# EAGLE design Filtro 8vo Orden (EAGLE 9.6.1)
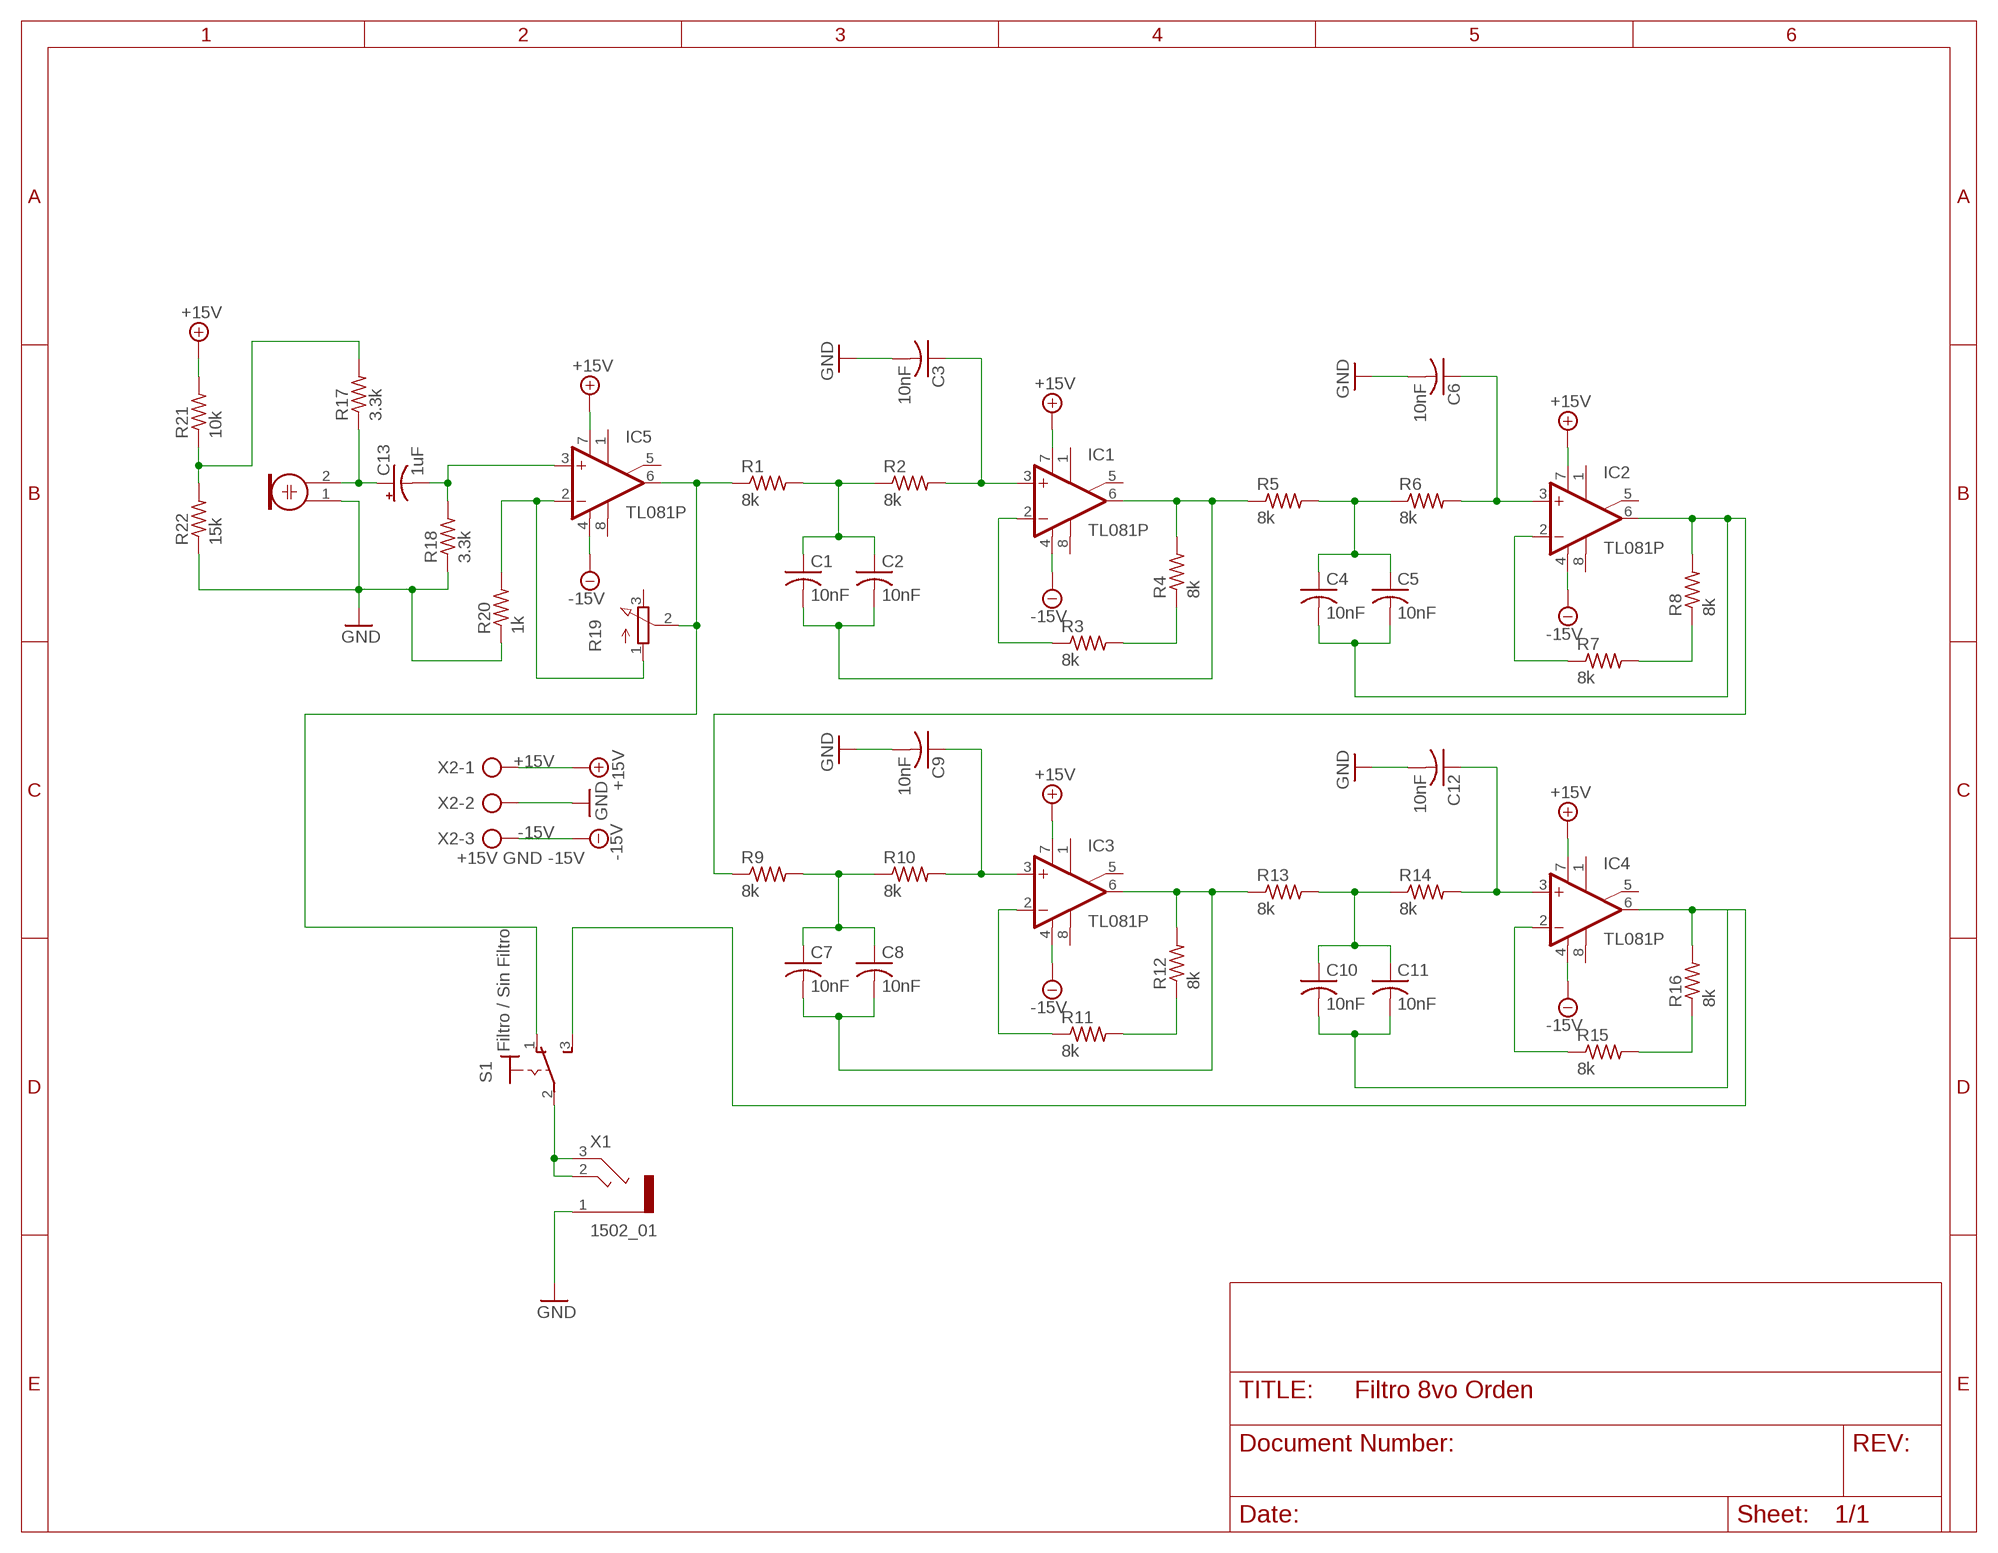
[diagram p0: schematic, sheet 1]

## Parts
C1  10nF  C-USC0805  [C0805]
C2  10nF  C-USC0805  [C0805]
C3  10nF  C-USC0805  [C0805]
C4  10nF  C-USC0805  [C0805]
C5  10nF  C-USC0805  [C0805]
C6  10nF  C-USC0805  [C0805]
C7  10nF  C-USC0805  [C0805]
C8  10nF  C-USC0805  [C0805]
C9  10nF  C-USC0805  [C0805]
C10  10nF  C-USC0805  [C0805]
C11  10nF  C-USC0805  [C0805]
C12  10nF  C-USC0805  [C0805]
C13  1uF  CPOL-USE1.8-4  [E1,8-4]
IC1  TL081P  [DIL08]
IC2  TL081P  [DIL08]
IC3  TL081P  [DIL08]
IC4  TL081P  [DIL08]
IC5  TL081P  [DIL08]
M1  ELECTRET_MICROPHONWM-63PR  [WM-63PR]
R1  8k  R-US_0204/7  [0204/7]
R2  8k  R-US_0204/7  [0204/7]
R3  8k  R-US_0204/7  [0204/7]
R4  8k  R-US_0204/7  [0204/7]
R5  8k  R-US_0204/7  [0204/7]
R6  8k  R-US_0204/7  [0204/7]
R7  8k  R-US_0204/7  [0204/7]
R8  8k  R-US_0204/7  [0204/7]
R9  8k  R-US_0204/7  [0204/7]
R10  8k  R-US_0204/7  [0204/7]
R11  8k  R-US_0204/7  [0204/7]
R12  8k  R-US_0204/7  [0204/7]
R13  8k  R-US_0204/7  [0204/7]
R14  8k  R-US_0204/7  [0204/7]
R15  8k  R-US_0204/7  [0204/7]
R16  8k  R-US_0204/7  [0204/7]
R17  3.3k  R-US_0204/7  [0204/7]
R18  3.3k  R-US_0204/7  [0204/7]
R19  3RP/1610N  [3RP/1610N]
R20  1k  R-US_0204/7  [0204/7]
R21  10k  R-US_0204/7  [0204/7]
R22  15k  R-US_0204/7  [0204/7]
S1  Filtro / Sin Filtro  320-916  [320-916]
X1  1502_01  [1502_01]
X2  +15V GND -15V  AK300/3  [AK300/3]

## Nets
+15V: IC1.7(V+) IC2.7(V+) IC3.7(V+) IC4.7(V+) IC5.7(V+) R21.2 X2.1
-15V: IC1.4(V-) IC2.4(V-) IC3.4(V-) IC4.4(V-) IC5.4(V-) X2.3
GND: C3.2 C6.2 C9.2 C12.2 M1.1 R18.1 R20.1 R22.1 X1.1 X2.2
N$1: C6.1 IC2.3(+IN) R6.2
N$2: C3.1 IC1.3(+IN) R2.2
N$3: R3.2 R4.1
N$4: C4.1 C5.1 R5.2 R6.1
N$5: C4.2 C5.2 IC2.6(OUT) R8.2 R9.1
N$6: C1.1 C2.1 R1.2 R2.1
N$7: C1.2 C2.2 IC1.6(OUT) R4.2 R5.1
N$8: IC1.2(-IN) R3.1
N$9: IC2.2(-IN) R7.1
N$10: R7.2 R8.1
N$11: C9.1 IC3.3(+IN) R10.2
N$12: C7.1 C8.1 R9.2 R10.1
N$13: C7.2 C8.2 IC3.6(OUT) R12.2 R13.1
N$14: IC3.2(-IN) R11.1
N$15: R11.2 R12.1
N$16: C12.1 IC4.3(+IN) R14.2
N$17: C10.1 C11.1 R13.2 R14.1
N$18: C10.2 C11.2 IC4.6(OUT) R16.2 S1.3(S)
N$19: IC4.2(-IN) R15.1
N$20: R15.2 R16.1
N$21: C13.+ M1.2 R17.1
N$22: C13.- IC5.3(+IN) R18.2
N$23: R17.2 R21.1 R22.2
N$24: IC5.2(-IN) R19.1(A) R20.2
N$26: S1.2(P) X1.2 X1.3
N$28: IC5.6(OUT) R1.1 R19.2(S) S1.1(O)
Unconnected: IC1.1(ON1) IC1.5(ON2) IC1.8(OPT) IC2.1(ON1) IC2.5(ON2) IC2.8(OPT) IC3.1(ON1) IC3.5(ON2) IC3.8(OPT) IC4.1(ON1) IC4.5(ON2) IC4.8(OPT) IC5.1(ON1) IC5.5(ON2) IC5.8(OPT) R19.3(E)

## Library data of the parts
C1-C12 = rcl:C-US: CAPACITOR, American symbol; SPICEPREFIX: C
C13 = rcl:CPOL-US: POLARIZED CAPACITOR, American symbol; SPICEPREFIX: C
IC1-IC5 = linear:TL081: OP AMP
M1 = Componentes_Filtros:ELECTRET_MICROPHON: Electret Condenser Microphone
R1-R18 R20-R22 = rcl:R-US_: RESISTOR, American symbol; SPICEPREFIX: R
R19 = Componentes_Filtros:3RP/1610N: 16mm Potentiometer one level Source: http://www.alphapotentiometers.net/html/16mm_pot_2.html
S1 = Componentes_Filtros:320-916: TOGGLE SWITCH distributor RS Components
X1 = Componentes_Filtros:1502_01: Jack connectors according to JISC 6560, 3.5 mm Klinkensteckverbinder nach JISC 6560, 3,5 mm Source: http://www.lumberg.com/Produkte/PDFs/1502_01.pdf; OC_FARNELL: 4739747; OC_NEWARK: unknown
X2 = Componentes_Filtros:AK300/3: CONNECTOR; OC_FARNELL: unknown; OC_NEWARK: unknown

## Board
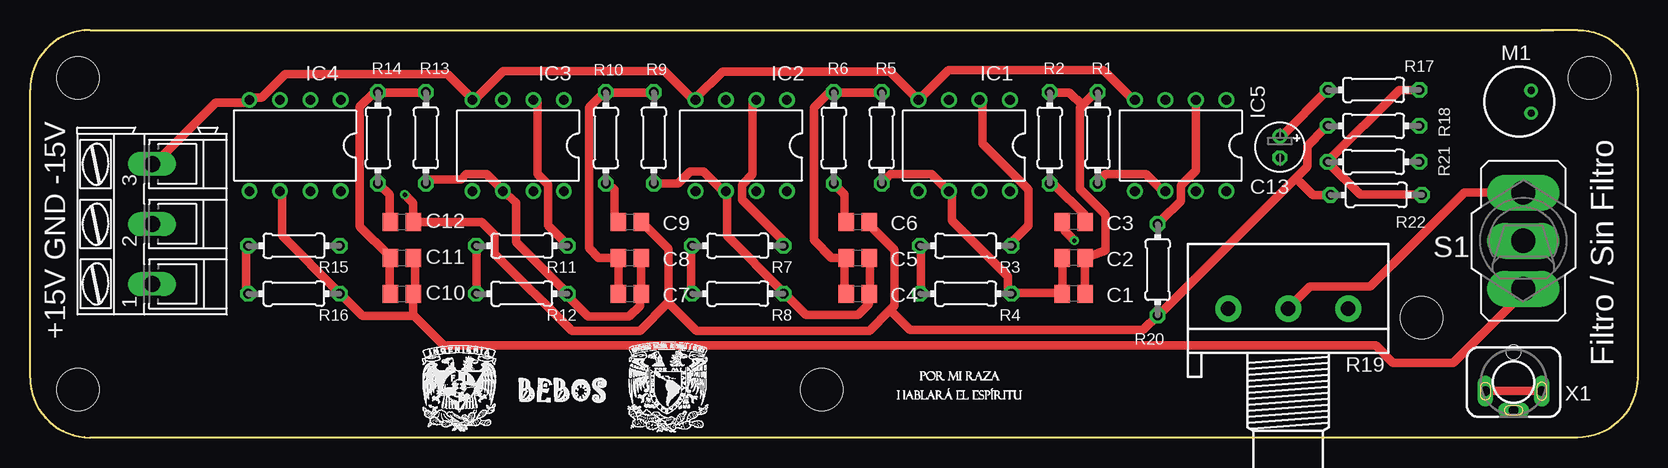
[diagram p1: board, top side]
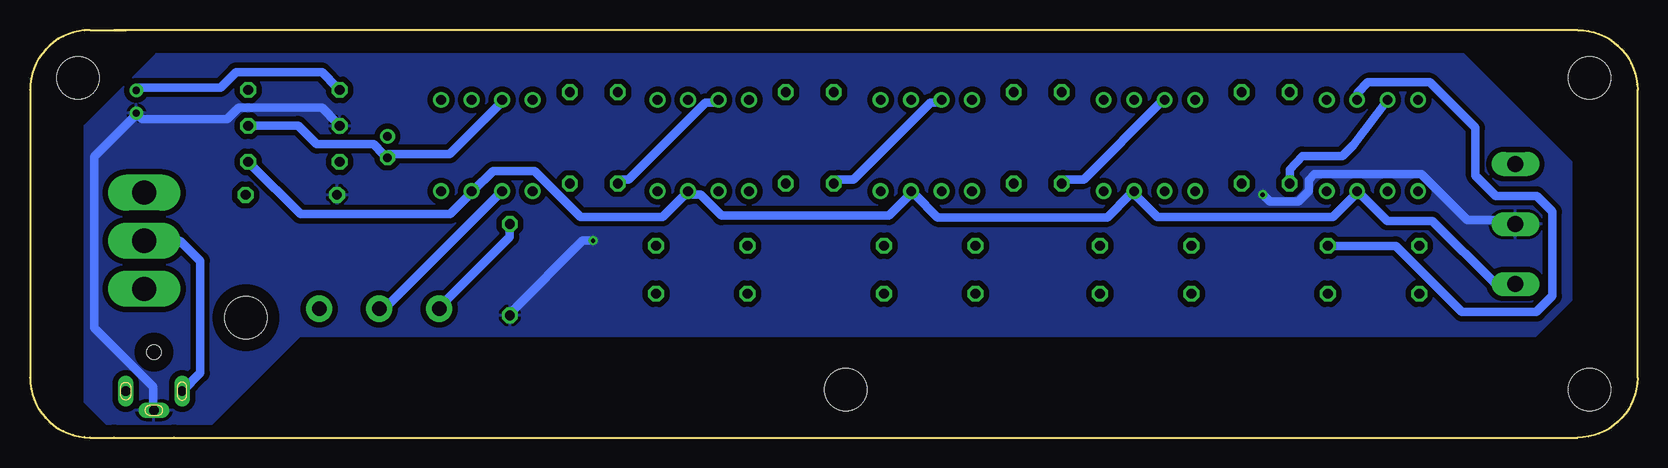
[diagram p2: board, bottom side, seen from below]

Size 134 x 34 mm. Coordinates in mm from the lower left corner, seen from the top.
Outline: 126,34 5,34 arc90 0,29 0,5 arc90 5,0 122,0
Outline: 126,34 127,34
Outline: 127,0 122,0
Outline: 126,34 129,34 arc-90 134,29 134,5 arc-90 129,0 122,0
Copper layers (1*16): Top 0.035mm / dielectric 1.5mm / Bottom 0.035mm
Design rules "default *": minimum track width 0.7mm, minimum drill 0.35mm, track to track 6mil, track to pad 6mil, pad to pad 6mil, via to via 6mil, smd to smd 6mil, copper to edge 40mil, drill to drill 6mil, minimum pad ring 10mil, minimum via ring 8mil, stop-mask expansion 4mil, vias tented up to drill 0mil, thermal gap 10mil
Holes 3.5 mm at 4,30 4,4 66,4 116,10 130,30

### Footprints (pad centres in the part's own frame; a part is rotated, then mirrored left to right if it is on the bottom)
C0805 = smd 1.3 x 1.5: 1 -0.95,0; 2 0.95,0
E1,8-4 = drill 0.711 pad 1.168: + -0.889,0 | drill 0.711 pad 1.168 octagon: - 0.889,0
DIL08 = drill 0.813 pad 1.27: 1 -3.81,-3.81; 2 -1.27,-3.81; 3 1.27,-3.81; 4 3.81,-3.81; 5 3.81,3.81; 6 1.27,3.81; 7 -1.27,3.81; 8 -3.81,3.81
WM-63PR = drill 0.6 pad 1: 1 -1,0.95; 2 -1,-0.95
0204/7 = drill 0.813 octagon: 1 -3.81,0; 2 3.81,0
3RP/1610N = drill 1.2 pad 2.184: 1 -5,0; 2 0,0; 3 5,0
320-916 = drill 2.007 long: 1 0,4.013; 2 0,0; 3 0,-4.013
1502_01 = drill 0.8 pad 1.2 long: 1 0,2.35; 2 -2.35,0.75; 3 2.35,0.75 | hole 1.2: 0,-2.5
AK300/3 = drill 1.321 long: 1 -5.004,0; 2 0,0; 3 5.004,0

### Placement (x,y rotation side)
C1  87,12 180 top
C2  87,15 180 top
C3  87,18 180 top
C4  69,12 0 top
C5  69,15 0 top
C6  69,18 0 top
C7  50,12 0 top
C8  50,15 0 top
C9  50,18 0 top
C10  31,12 0 top
C11  31,15 0 top
C12  31,18 0 top
C13  104.19,24.23 270 top
IC1  77.87,24.36 180 top
IC2  59.28,24.36 180 top
IC3  40.69,24.36 180 top
IC4  22.1,24.36 180 top
IC5  95.92,24.36 180 top
M1  124.13,28.01 180 top
R1  89,25 90 top
R2  85,25 270 top
R3  78,16 180 top
R4  78,12 0 top
R5  71,25 90 top
R6  67,25 270 top
R7  59,16 180 top
R8  59,12 0 top
R9  52,25 90 top
R10  48,25 270 top
R11  41,16 180 top
R12  41,12 0 top
R13  33,25 90 top
R14  29,25 270 top
R15  22,16 180 top
R16  22,12 0 top
R17  112,29 0 top
R18  112,26 0 top
R19  104.89,10.75 0 top
R20  94,14 90 top
R21  112,23 0 top
R22  112.22,20.24 0 top
S1  124.48,16.41 0 top
X1  123.67,4.62 180 top
X2  10.18,17.81 90 top

### Tracks (layer width: path | path; a pad name or v marks a point on that pad's centre or on a via)
+15V
  Bottom 0.7: X2.1 11.82,12.81 17.09,18.07 20.87,18.07 23.06,20.26 23.14,20.26 IC4.7 23.37,20.42 25.39,18.4 40.04,18.4 41.9,20.26 IC3.7 42.32,20.26 44.2,18.37 58.34,18.37 60.22,20.26 IC2.7 60.65,20.26 62.4,18.51 76.37,18.51 78.12,20.26 78.98,20.26 IC1.7 79.4,20.26 81.25,18.41 88.11,18.41 91.94,22.24 95.39,22.24 97,20.63 IC5.7 97.3,20.26 97.33,20.26 98.96,18.63 111.44,18.63 115.63,22.81 R21.2
-15V
  Top 0.7: IC5.4 91.76,28.35 89.47,30.65 76.58,30.65 74.29,28.35 IC1.4 73.86,28.35 71.67,30.54 57.72,30.54 55.53,28.35 IC2.4 55.11,28.35 52.9,30.56 39.42,30.56 37.21,28.35 IC3.4 36.78,28.35 34.83,30.31 21.27,30.31 19.31,28.35 18.46,28.35 IC4.4 18.03,27.93 15.47,27.93 10.36,22.81 X2.3
GND  (via drill 0.35)
  Top 0.7: v87.07,16.42 86.22,17.27 86.22,17.7 C3.2 | R22.1 106.96,20.24 105.53,21.67 | R18.1 107.96,25.8 106.49,24.33 106.49,22.62 105.53,21.67 | 105.53,21.67 94.32,10.45 R20.1 92.77,8.96 73.37,8.96 71.69,10.64 | 53.2,11.26 53.23,11.29 53.23,15.74 51.27,17.7 C9.2 | 53.2,11.26 50.84,8.9 45.17,8.9 38.74,15.33 38.74,16.9 37.64,18 C12.2 | C12.2 32.09,17.7 | 71.69,10.64 69.96,8.91 55.56,8.91 53.2,11.26 | 71.69,10.64 72.08,11.03 72.08,15.65 70.03,17.7 C6.2 | v31.24,20.26 31.94,19.56 31.94,19.51 31.95,19.5 C12.2
  Bottom 0.7: v87.07,16.42 87.93,16.42 93.89,10.45 R20.1 | R18.1 108.38,26.22 109.66,27.5 116.61,27.5 117.54,26.57 124.64,26.57 M1.1 125.43,26.65 128.64,23.44 128.64,9.15 123.73,4.24 123.73,2.36 X1.1 | v31.24,20.26 30.66,19.68 28.28,19.68 27.4,20.56 27.4,21.49 26.93,21.96 18.03,21.96 14.19,18.13 10.36,18.13 X2.2
  pour Bottom (isolate 0.45): 5.5,15.5 5.5,23 14.5,32 123.5,32 129.5,26 129.5,3 127.5,1 119,1 111.5,8.5 8.5,8.5 6,11 5.5,11.5
N$1
  Top 0.7: C6.1 67.89,18.13 67.89,20.26 67.04,21.11 R6.2
  Bottom 0.7: IC2.3 58.09,27.93 58.94,27.93 65.34,21.53 66.62,21.53 R6.2
N$2
  Top 0.7: C3.1 87.93,18.13 87.93,18.55 85.37,21.11 R2.2
  Bottom 0.7: IC1.3 76.84,27.93 77.7,27.93 84.09,21.53 84.94,21.53 R2.2
N$3
  Top 0.7: R4.1 74.29,12.16 74.29,16 R3.2
N$4
  Top 0.7: C4.1 67.89,12.16 67.89,14.72 C5.1 66.83,15 65.34,16.49 65.34,27.5 66.62,28.78 R6.1 67.04,28.78 70.88,28.78 R5.2
N$5
  Top 0.7: R9.1 54.02,21.2 55.01,22.19 56.16,22.19 57.67,20.68 IC2.6 58.09,20.26 58.09,16.85 62.78,12.16 R8.2 63.21,11.73 64.69,10.24 69.04,10.24 69.94,11.14 69.94,11.99 C4.2 70.03,12.16 70.03,14.72 C5.2
N$6
  Top 0.7: C1.1 87.93,12.16 87.93,14.72 C2.1 89.66,15.6 89.66,18.59 87.5,20.74 87.5,27.5 87.71,27.72 | 87.71,27.72 88.78,28.78 R1.2 | 87.71,27.72 86.65,28.78 85.37,28.78 R2.1
N$7
  Top 0.7: C2.2 C1.2 85.93,12.08 81.88,12.08 R4.2 81.53,12.16 81.53,13.44 76.84,18.12 76.84,20.26 IC1.6 76.42,20.68 75.14,21.96 71.73,21.96 71.31,21.53 R5.1
N$8
  Top 0.7: IC1.2 79.4,27.93 79.4,24.52 83.24,20.68 83.24,17.7 81.96,16.42 R3.1
N$9
  Top 0.7: IC2.2 60.22,27.93 60.22,21.96 59.33,21.07 59.33,19.87 62.78,16.42 R7.1
N$10
  Top 0.7: R8.1 55.11,12.16 55.11,16 R7.2
N$11
  Top 0.7: C9.1 48.72,18.13 48.72,20.68 48.29,21.11 R10.2
  Bottom 0.7: IC3.3 39.77,27.93 46.16,21.53 47.86,21.53 R10.2
N$12
  Top 0.7: C7.1 49.06,12.01 49.06,14.97 C8.1 47.41,15 46.58,15.82 46.58,27.5 47.86,28.78 R10.1 48.29,28.78 51.7,28.78 R9.2
N$13
  Top 0.7: R13.1 33.37,21.53 35.93,21.53 36.36,21.96 38.06,21.96 39.34,20.68 IC3.6 40.52,19.62 40.52,16.32 44.81,12.03 R12.2 44.88,11.73 46.51,10.1 49.96,10.1 50.85,10.99 50.85,11.73 C7.2 50.93,12.03 50.93,14.95 C8.2
N$14
  Top 0.7: IC3.2 42.32,27.93 42.32,21.96 43.17,21.11 43.17,17.7 44.45,16.42 R11.1
N$15
  Top 0.7: R12.1 37.21,12.16 37.21,16 R11.2
N$16
  Top 0.7: C12.1 29.96,18.13 29.96,20.26 29.11,21.11 R14.2
  Bottom 0.7: IC4.3 23.69,24.39 24.59,23.49 27.96,23.49 29,22.35 R14.2
N$17
  Top 0.7: C10.1 29.96,12.16 29.96,14.72 C11.1 29.96,15.14 27.5,17.61 27.5,27.59 28.69,28.78 R14.1 29.11,28.78 32.95,28.78 R13.2
N$18
  Top 0.7: C10.2 32.09,12.16 32.09,14.72 C11.2 | 31.95,10.13 27.73,10.13 26.13,11.73 R16.2 25.7,12.16 21.01,16.85 21.01,20.26 IC4.6 | 31.95,10.13 32.03,10.13 34.49,7.67 112.18,7.67 113.62,6.22 118.63,6.22 124.57,12.16 | C10.2 31.9,11.95 31.81,12.05 | 124.57,12.16 124.58,12.16 | C10.2 31.95,10.13 | S1.3 124.57,12.31 124.57,12.16
N$19
  Bottom 0.7: IC4.2 23.37,28.73 22.47,29.63 17.32,29.63 13.52,25.83 13.52,21.88 11.8,20.16 8.42,20.16 7.1,18.84 7.1,11.8 8.42,10.48 14.64,10.48 20.16,16 25.7,16 R15.1
N$20
  Top 0.7: R16.1 18.03,12.16 18.03,16 R15.2
N$21
  Top 0.7: C13.+ 104.55,25.37 107.96,28.78 R17.1
  Bottom 0.7: M1.2 125.01,29.21 118.1,29.21 116.83,30.48 109.66,30.48 108.38,29.21 R17.1
N$22
  Bottom 0.7: IC5.3 94.75,27.93 99.01,23.67 104.12,23.67 C13.- 104.55,23.67 105.34,24.46 110.09,24.46 111.65,26.03 115.78,26.03 R18.2
N$23
  Top 0.7: R21.1 108.16,23 | 108.16,23 108.14,23.01 114.13,29 R17.2 | 108.16,23 110.9,20.26 115.63,20.26 R22.2
N$24
  Top 0.7: IC5.2 97.18,28.16 97.18,22.26 95.92,21 95.92,19.73 94.32,18.13 R20.2
  Bottom 0.7: R20.2 94.01,17.81 94.01,16.73 99.86,10.88 R19.1
N$26
  Top 0.7: X1.3 121.34,3.89 126.01,3.89 X1.2
  Bottom 0.7: X1.3 119.81,5.39 119.81,14.74 121.48,16.41 S1.2
N$28
  Top 0.7: IC5.6 94.32,20.68 93.04,21.96 89.63,21.96 89.2,21.53 R1.1 | R19.2 104.97,10.88 106.68,12.58 111.72,12.58 119.56,20.43 S1.1
  Bottom 0.7: R19.2 104.18,11.02 IC5.6

### Text on the board
tNames: +15V GND -15V | Filtro / Sin Filtro